# EAGLE design stknx_breakout_v14 (EAGLE 9.6.1)
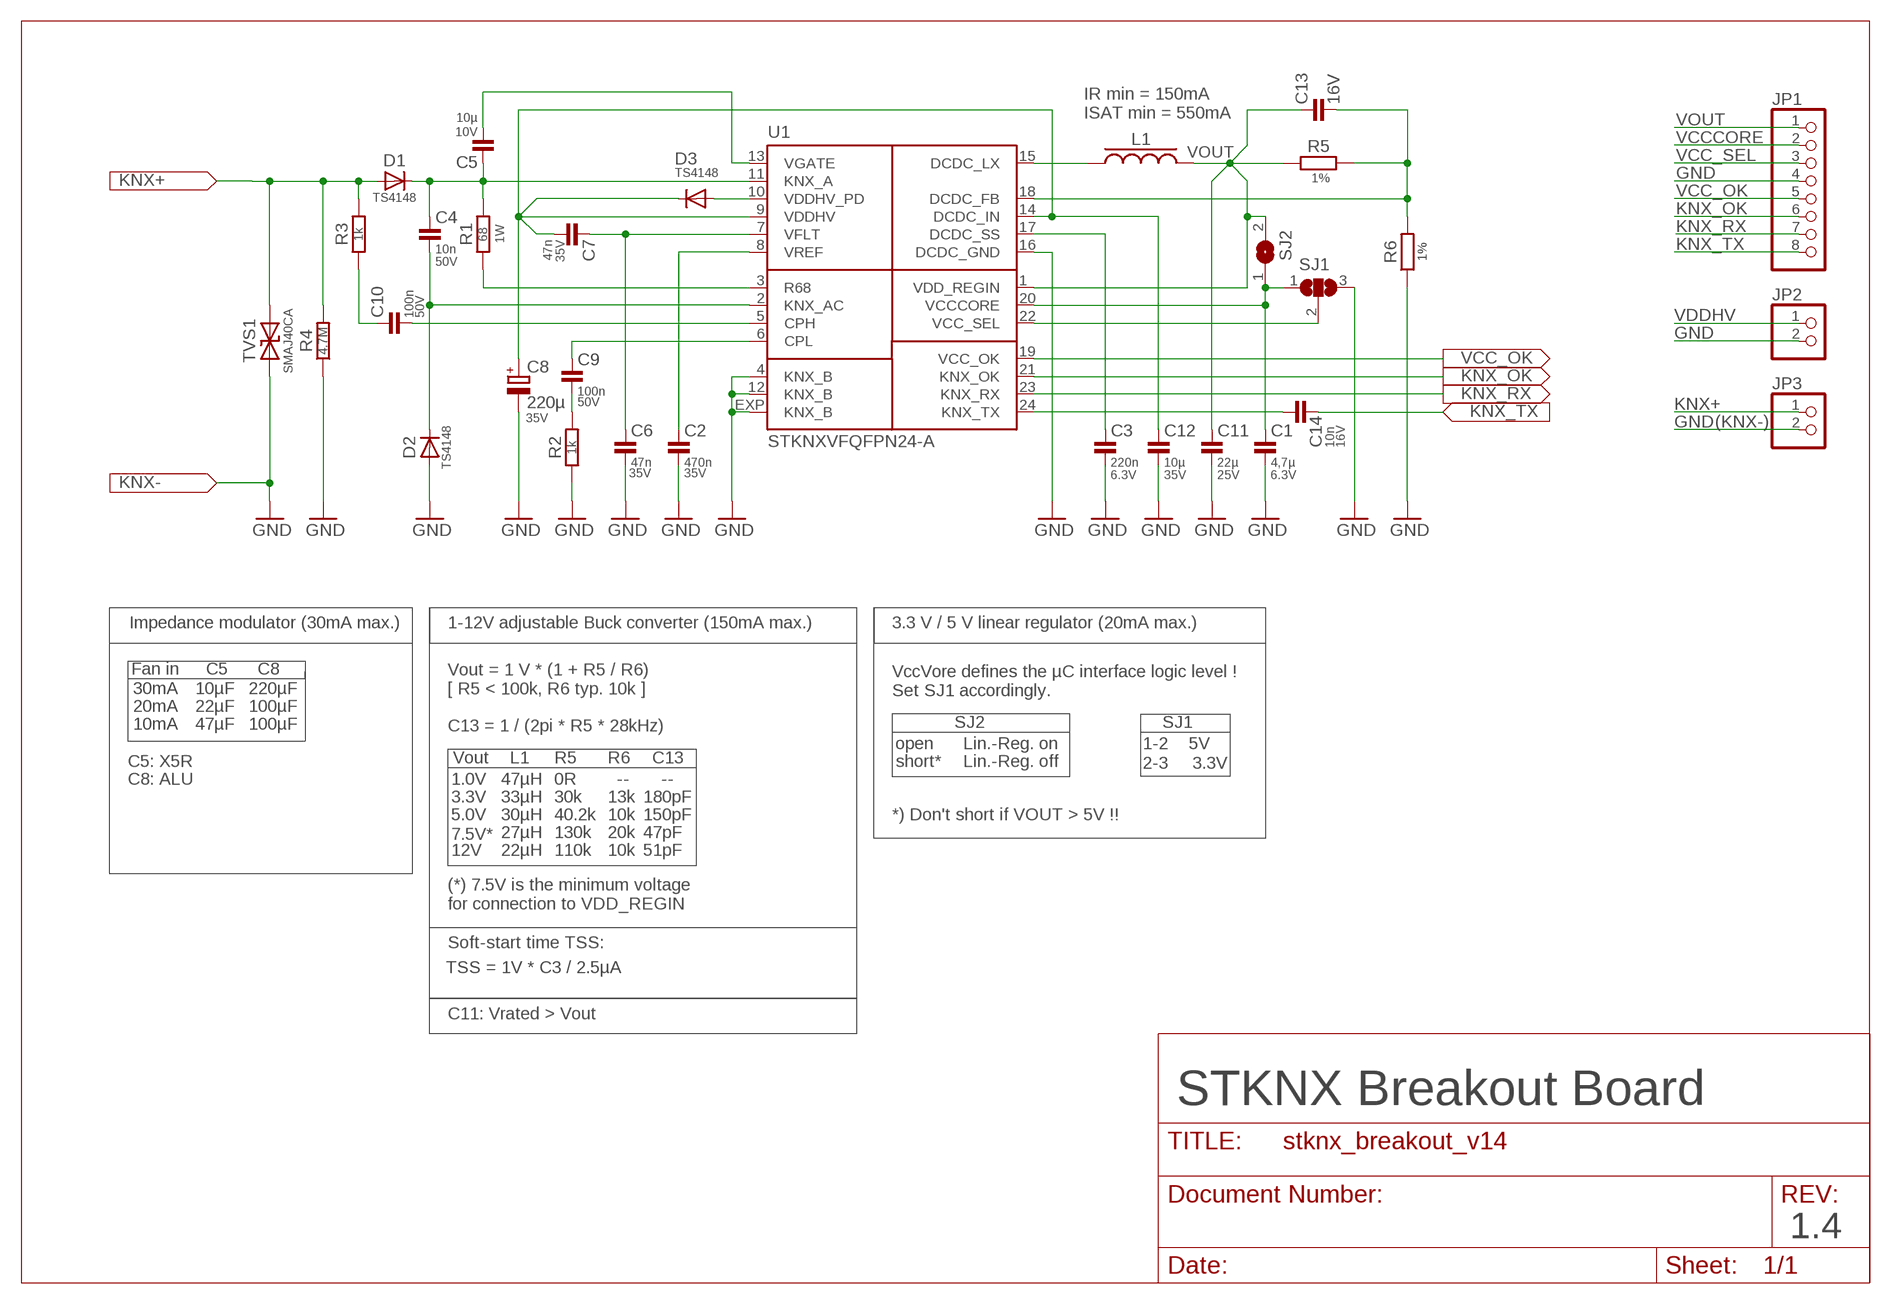
[diagram p0: schematic, sheet 1]

## Parts
C1  4,7µ  C-EUC0805  [C0805]
C2  470n  C-EUC0805  [C0805]
C3  220n  C-EUC0805  [C0805]
C4  10n  C-EUC0805  [C0805]
C5  10µ  C-EUC0805  [C0805]
C6  47n  C-EUC0805  [C0805]
C7  47n  C-EUC0805  [C0805]
C8  220µ  CPOL-EUF  [PANASONIC_F]
C9  100n  C-EUC0805  [C0805]
C10  100n  C-EUC0805  [C0805]
C11  22µ  C-EUC0805  [C0805]
C12  10µ  C-EUC0805  [C0805]
C13  C13  C-EUC0805  [C0805]
C14  10n  C-EUC0805  [C0805]
D1  TS4148  [0805]
D2  TS4148  [0805]
D3  TS4148  [0805]
JP1  PINHD-1X8  [1X08]
JP2  PINHD-1X2  [1X02]
JP3  PINHD-1X2  [1X02]
L1  L1  WE-LQS_4025_74404043220A  [WE-LQS_4025]
R1  68  R-EU_R2512  [R2512]
R2  1k  R-EU_R0805  [R0805]
R3  1k  R-EU_R0805  [R0805]
R4  4.7M  R-EU_R0805  [R0805]
R5  R5  R-EU_R0805  [R0805]
R6  R6  R-EU_R0805  [R0805]
SJ1  SJ2W  [SJ_2W]
SJ2  SJW  [SJW]
TVS1  SMAJ40CA  [DO-214AC(SMA)]
U1  STKNXVFQFPN24-A  [VFQFPN24-A]

## Nets
DCDC_FB: C13.2 R5.2 R6.2 U1.18(DCDC_FB)
DCDC_SS: C3.1 U1.17(DCDC_SS)
GND: C1.2 C2.2 C3.2 C6.2 C8.- C11.2 C12.2 D2.A JP1.4 JP2.2 JP3.2 R2.1 R4.1 R6.1 SJ1.3 TVS1.2(A2) U1.4(KNX_B) U1.12(KNX_B) U1.16(DCDC_GND) U1.EXP(KNX_B)
KNX+: D1.A JP3.1 R3.2 R4.2 TVS1.1(A1)
KNX_OK: JP1.6 U1.21(KNX_OK)
KNX_RX: JP1.7 U1.23(KNX_RX)
KNX_TX: C14.2 JP1.8
KNX_TX_1: C14.1 U1.24(KNX_TX)
N$1: C2.1 U1.8(VREF)
N$3: C6.1 C7.1 U1.7(VFLT)
N$4: R1.1 U1.3(R68)
N$6: C4.2 D2.C U1.2(KNX_AC)
N$7: C4.1 C5.1 D1.C R1.2 U1.11(KNX_A)
N$9: D3.A U1.10(VDDHV_PD)
N$10: C9.2 R2.2
N$11: C9.1 U1.6(CPL)
N$12: C10.1 R3.1
N$14: C10.2 U1.5(CPH)
N$15: L1.1 U1.15(DCDC_LX)
VCC_OK: JP1.5 U1.19(VCC_OK)
VCC_SEL: JP1.3 SJ1.2 U1.22(VCC_SEL)
VCCCORE: C1.1 JP1.2 SJ1.1 SJ2.1 U1.20(VCCCORE)
VDDHV: C7.2 C8.+ C12.1 D3.C JP2.1 U1.9(VDDHV) U1.14(DCDC_IN)
VGATE: C5.2 U1.13(VGATE)
VOUT: C11.1 C13.1 JP1.1 L1.2 R5.1 SJ2.2 U1.1(VDD_REGIN)

## Notes on the sheet
- IR min = 150mA
  ISAT min = 550mA
- 1W
- (KNX-)
- Impedance modulator (30mA max.) | 1-12V adjustable Buck converter (150mA max.) | 3.3 V / 5 V linear regulator (20mA max.)
- Fan in | C5 | C8
- 30mA | 10µF | 220µF
- VccVore defines the µC interface logic level !
  Set SJ1 accordingly.
- 20mA | 22µF | 100µF
- 10mA | 47µF | 100µF | SJ2 | SJ1
- Vout = 1 V * (1 + R5 / R6)
  [ R5 < 100k, R6 typ. 10k ]
  
  C13 = 1 / (2pi * R5 * 28kHz)
- open | Lin.-Reg. on | 1-2 | 5V
- C5: X5R | Vout | L1 | R5 | R6 | C13 | short* | Lin.-Reg. off
- 2-3 | 3.3V
- C8: ALU | 1.0V | 47µH | 0R | -- | --
- 3.3V | 33µH | 30k | 13k | 180pF
- 5.0V | 30µH | 40.2k | 10k | 150pF | *) Don't short if VOUT > 5V !!
- 7.5V* | 27µH | 130k | 20k | 47pF
- 12V | 22µH | 110k | 10k | 51pF
- (*) 7.5V is the minimum voltage
  for connection to VDD_REGIN
- Soft-start time TSS:
- TSS = 1V * C3 / 2.5µA
- C11: Vrated > Vout
- STKNX Breakout Board
- 1.4

## Library data of the parts
C1 = MyRCL:C-EU: CAPACITOR, European symbol; DIELECTRIC: X5R; SPICEPREFIX: C; TYPE: MLCC; VOLTAGE: 6.3V
C2 C6 C7 C12 = MyRCL:C-EU: CAPACITOR, European symbol; SPICEPREFIX: C; TYPE: MLCC; VOLTAGE: 35V
C3 = MyRCL:C-EU: CAPACITOR, European symbol; SPICEPREFIX: C; TYPE: MLCC; VOLTAGE: 6.3V
C4 C9 C10 = MyRCL:C-EU: CAPACITOR, European symbol; SPICEPREFIX: C; TYPE: MLCC; VOLTAGE: 50V
C5 = MyRCL:C-EU: CAPACITOR, European symbol; DIELECTRIC: X5R; SPICEPREFIX: C; TYPE: MLCC; VOLTAGE: 10V
C8 = resistor:CPOL-EU: POLARIZED CAPACITOR, European symbol; PANASONIC: EEEFT1H221AP; REICHELT: FT-V 220U 50; TYPE: ELYT; VOLTAGE: 35V
C11 = MyRCL:C-EU: CAPACITOR, European symbol; DIELECTRIC: X5R; SPICEPREFIX: C; TYPE: MLCC; VOLTAGE: 25V
C13 C14 = MyRCL:C-EU: CAPACITOR, European symbol; SPICEPREFIX: C; TYPE: MLCC; VOLTAGE: 16V
D1-D3 = MyDiode:TS4148: Small Signal Fast Switching Diodes
JP1 = pinhead:PINHD-1X8: PIN HEADER
JP2 JP3 = pinhead:PINHD-1X2: PIN HEADER
L1 = MyPowerMagnetics:WE-LQS_4025: SMD Shielded Tiny Power Inductor Characteristics Tiny Power Inductor design 1.7 times more current in comparison with unshielded versions Robust design & high durability Low RDC Magnetically shielded with magnetic glue reducing buzz noise in ultra-low levels Operating Temperature: –40 °C to +125 °C Applications Integrated DC/DC Converters Switching controllers which required high efficiency Portable power (Smartphones, digital cameras, Tablets, etc.) Embedded laptops and PCs Big sizes (5040, 60xx, 8040) used for shock-proof circuits <http://katalog.we-online.de/media/images/v2/Family_WE-LQS.jpg> Details see: http://katalog.we-online.de/en/pbs/WE-LQS Created by Dan Xu 2014-05-21 2014 (C) Wurth Elektronik; WE-NUMBER: 74404043220A/22uH
R1-R4 = MyRCL:R-EU_: RESISTOR, European symbol
R5 R6 = MyRCL:R-EU_: RESISTOR, European symbol; TOLERANCE: 1%
SJ1 = MyJumper:SJ2: SMD solder JUMPER
SJ2 = MyJumper:SJ: SMD solder JUMPER
TVS1 = MyDiode:SMAJ*CA: Transient Voltage Suppressor Diode https://www.vishay.com/docs/88390/smaj50a.pdf; MARKING: YR; WURTH_ELEKTRONICS: 824501401
U1 = stknx:STKNX: STKNX Miniature KNX transceiver with voltage regulators see: http://www.st.com/content/st_com/en/products/interfaces-and-transceivers/power-line-transceivers/stknx.html

## Board
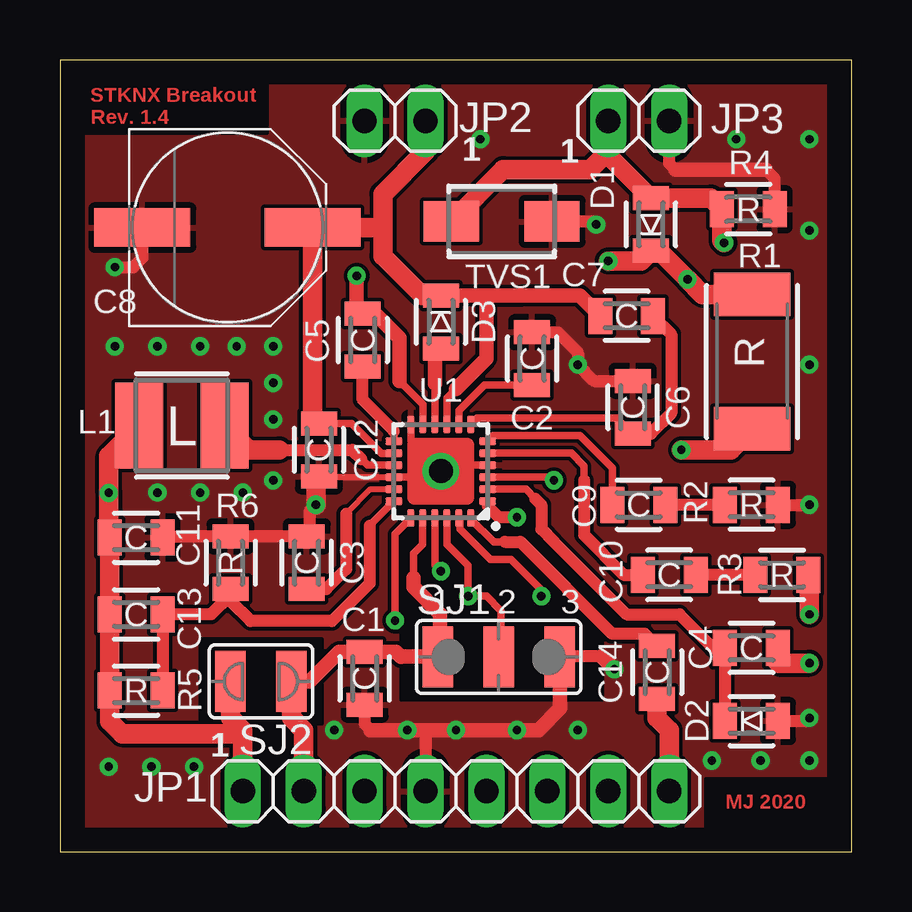
[diagram p1: board, top side]
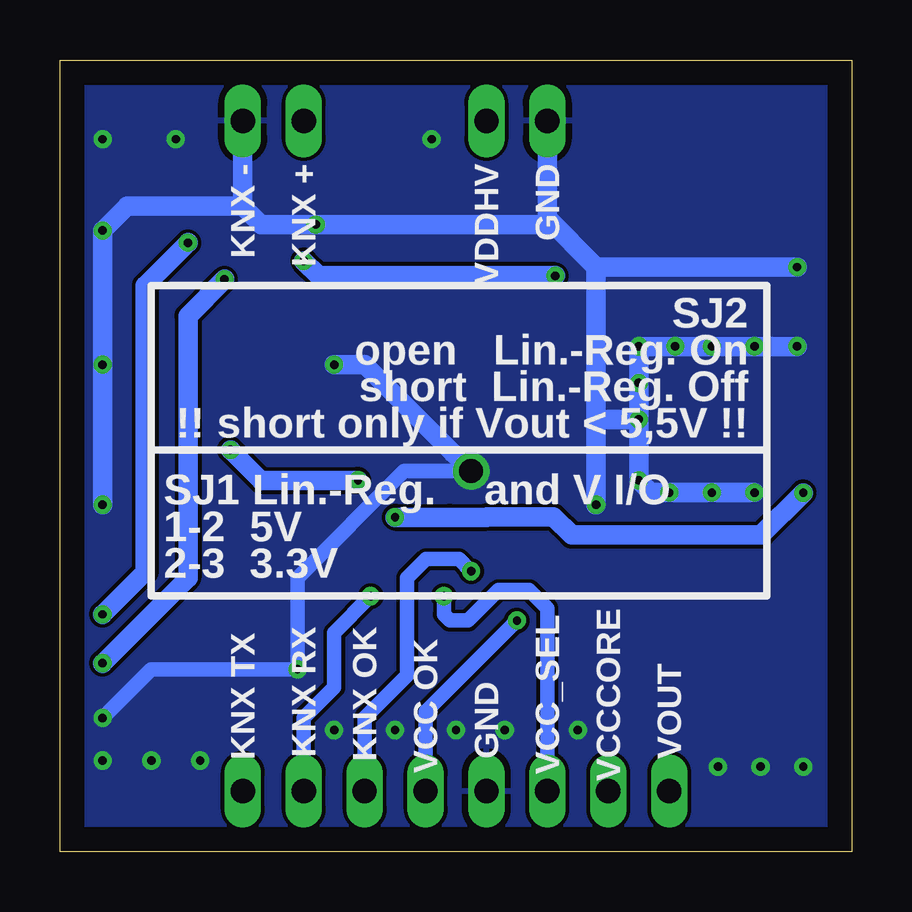
[diagram p2: board, bottom side, seen from below]

Size 33.02 x 33.02 mm. Coordinates in mm from the lower left corner, seen from the top.
Outline: 33.02,33.02 0,33.02 0,0 33.02,0 33.02,33.02
Copper layers (1*16): Top 0.035mm / dielectric 1.5mm / Bottom 0.035mm
Design rules "default *": minimum track width 6mil, minimum drill 0.35mm, track to track 6mil, track to pad 6mil, pad to pad 6mil, via to via 6mil, smd to smd 6mil, copper to edge 40mil, drill to drill 6mil, minimum pad ring 10mil, minimum via ring 8mil, stop-mask expansion 4mil, vias tented up to drill 0mil, thermal gap 10mil

### Footprints (pad centres in the part's own frame; a part is rotated, then mirrored left to right if it is on the bottom)
C0805 = smd 1 x 1.5: 1 -1.1,0; 2 1.1,0
PANASONIC_F = smd 4 x 1.6: + 3.55,0; - -3.55,0
0805 = smd 1 x 1.5: A 1.1,0; C -1.1,0
1X08 = drill 1.016 long: 1 -8.89,0; 2 -6.35,0; 3 -3.81,0; 4 -1.27,0; 5 1.27,0; 6 3.81,0; 7 6.35,0; 8 8.89,0
1X02 = drill 1.016 long: 1 -1.27,0; 2 1.27,0
WE-LQS_4025 = smd 2 x 3.6: 1 -1.775,0; 2 1.775,0
R2512 = smd 1.8 x 3.2: 1 -2.8,0; 2 2.8,0
R0805 = smd 1 x 1.5: 1 -1.1,0; 2 1.1,0
SJ_2W = smd 1.27 x 2.54: 1 -2.54,0; 2 0,0; 3 2.54,0
SJW = smd 1.27 x 2.54: 1 -1.27,0; 2 1.27,0
DO-214AC(SMA) = smd 2.3 x 1.7: 1 -2.1,0; 2 2.1,0
VFQFPN24-A = smd 0.7 x 0.3: 1 -1.95,1.25; 2 -1.95,0.75; 3 -1.95,0.25; 4 -1.95,-0.25; 5 -1.95,-0.75; 6 -1.95,-1.25; 13 1.95,-1.25; 14 1.95,-0.75; 15 1.95,-0.25; 16 1.95,0.25; 17 1.95,0.75; 18 1.95,1.25 | smd 0.3 x 0.7: 7 -1.25,-1.95; 8 -0.75,-1.95; 9 -0.25,-1.95; 10 0.25,-1.95; 11 0.75,-1.95; 12 1.25,-1.95; 19 1.25,1.95; 20 0.75,1.95; 21 0.25,1.95; 22 -0.25,1.95; 23 -0.75,1.95; 24 -1.25,1.95 | drill 1: EXP 0,0

### Placement (x,y rotation side)
C1  12.7,7.24 270 top
C2  19.68,20.57 90 top
C3  10.29,12.06 90 top
C4  28.83,8.51 180 top
C5  12.62,21.34 270 top
C6  23.88,18.54 90 top
C7  23.62,22.35 180 top
C8  6.99,26.04 0 top
C9  24.13,14.48 0 top
C10  25.4,11.56 180 top
C11  3.17,13.11 0 top
C12  10.79,16.76 270 top
C13  3.17,9.91 0 top
C14  24.89,7.49 270 top
D1  24.64,26.16 90 top
D2  28.83,5.46 0 top
D3  15.88,22.1 270 top
JP1  16.51,2.54 0 top
JP2  13.97,30.48 180 top
JP3  24.13,30.48 0 top
L1  5.08,17.78 180 top
R1  28.85,20.45 90 top
R2  28.83,14.48 180 top
R3  30.1,11.56 0 top
R4  28.7,26.8 180 top
R5  3.17,6.73 0 top
R6  7.11,12.06 270 top
SJ1  18.29,8.13 0 top
SJ2  8.38,7.11 180 top
TVS1  18.41,26.29 0 top
U1  15.88,15.88 180 top

### Tracks (layer width: path | path; a pad name or v marks a point on that pad's centre or on a via)
DCDC_FB
  Top 0.152: R6.2 7.11,10.71 | 5.71,9.91 C13.2
  Top 0.305: U1.18 12.91,13.61 | R6.2 7.11,10.45
  Top 0.508: R5.2 C13.2 5.71,9.91 6.31,9.91 7.11,10.71 | 12.91,13.61 12.91,11.2 11.34,9.63 7.94,9.63 7.11,10.45
DCDC_SS
  Top 0.254: 11.93,14.1 12.96,15.12 U1.17
  Top 0.508: C3.1 11.1,10.96 11.93,11.8 11.93,14.1
GND  (via drill 0.35)
  Top 0.152: 4.33,13.16 C11.2 | 13.91,15.64 U1.16 | U1.EXP 14.62,17.12 | 16.12,16.12 U1.EXP | U1.EXP 15.62,15.62 | 20.85,8.1 20.85,6.6
  Top 0.254: 13.91,15.64 10.86,15.64 10.84,15.66
  Top 0.305: 14.62,17.12 U1.12 | U1.4 16.12,16.12 | 15.62,15.62 U1.16 | 10.84,15.66 C12.2 10.67,15.54
  Top 0.508: 4.33,13.16 5.59,13.16 5.84,13.16 6.35,13.16 R6.1 C3.2 10.41,13.29 10.41,14.22 v10.67,14.48 | v22.35,26.16 22.23,26.29 TVS1.2 | C2.2 20.74,21.67 21.59,20.83 v21.59,20.32 22.27,19.64 C6.2 | R2.1 v31.24,14.48 | v31.24,5.59 31.11,5.46 D2.A | R4.1 29.8,28.07 29.42,28.45 | 25.65,28.45 25.4,28.7 JP3.2 | v2.29,24.38 3.05,24.38 3.44,24.77 C8.- | 15.24,5.08 JP1.4 | C1.2 12.7,5.33 12.95,5.08 | 22.58,8.15 20.85,8.15
  Top 0.61: 29.42,28.45 25.65,28.45 | 20.85,8.08 20.85,6.6 20.85,6 19.94,5.08 v19.05,5.08 v16.51,5.08 16,5.08 v14.48,5.08 | v14.48,5.08 15.24,5.08 | 12.95,5.08 v14.48,5.08 | v23.11,7.62 22.58,8.15 | 20.85,8.15 SJ1.3
  Top 0.813: v10.67,14.48 10.67,15.54
  Bottom 0.61: U1.EXP 18.67,15.88 23.11,11.43 v23.11,7.62 29.21,7.62 v31.24,5.59
  Bottom 0.813: 12.7,26.16 v22.35,26.16 24.64,26.16 25.4,26.92 | 12.7,26.16 12.83,26.29 12.7,26.42 | 12.7,26.42 10.67,24.38 | 10.67,24.38 10.67,18.03 | 10.67,18.03 v10.67,14.48 | v21.59,20.32 20.32,20.32 16.64,16.64 U1.EXP | v31.24,14.48 v31.24,20.32 31.24,23.11 v31.24,25.91 30.23,26.92 25.4,26.92 | 12.7,26.42 12.7,28.45 12.7,28.7 | 12.7,26.16 12.7,26.42 | 12.7,26.42 12.7,28.7 | 12.7,28.7 JP2.2 | JP3.2 25.4,29.21 25.4,26.92 | v2.29,21.08 v4.06,21.08 v5.84,21.08 v7.37,21.08 v8.89,21.08 v8.89,19.56 v8.89,18.03 | v8.89,18.03 v8.89,15.49 8.38,14.99 v7.62,14.99 v5.84,14.99 v4.06,14.99 | v8.89,18.03 10.67,18.03 | v2.29,24.38 10.67,24.38
  other vias: 21.59,5.08 11.43,5.08 2.03,3.56 3.81,3.56 5.59,3.56 27.18,3.81 29.21,3.81 31.24,3.81 17.53,29.72 28.19,29.72 31.24,29.72
  pour Bottom: 0.64,32.38 32.38,32.38 32.38,0.64 0.64,0.64
  pour Top: 0.64,32.38 32.38,32.38 32.38,0.64 0.64,0.64
KNX+  (via drill 0.35)
  Top 0.813: R3.2 31.24,11.51 v31.24,9.91 | TVS1.1 18.47,28.45 22.1,28.45 22.86,29.21 JP3.1 22.86,29.04 D1.A 27.14,27.26 R4.2 27.6,25.48 v27.69,25.4
  Bottom 0.813: v31.24,9.91 29.46,11.68 29.46,23.62 v27.69,25.4
KNX_OK  (via drill 0.35)
  Top 0.305: U1.21 15.62,11.96 v15.88,11.71
  Bottom 0.61: v15.88,11.71 16.39,12.21 17.76,12.21 18.54,11.43 18.54,7.37 20.32,5.59 JP1.6
KNX_RX  (via drill 0.35)
  Top 0.305: U1.23 16.67,13.88 16.67,13.47 17.95,12.19 18.8,12.19 20.07,10.92 v20.07,10.67
  Bottom 0.61: v20.07,10.67 21.59,9.14 21.59,6.86 22.86,5.59 JP1.7
KNX_TX
  Top 0.813: C14.2 24.89,5.59 25.4,5.08 JP1.8
KNX_TX_1
  Top 0.305: U1.24 17.14,13.9 17.14,13.87 18.09,12.93 18.54,12.93
  Top 0.508: 18.54,12.93 19.19,12.93 23.02,9.1 24.38,9.1 C14.1
N$1
  Top 0.305: U1.8 16.62,18.4 17.7,19.47 C2.1
N$2
  cutout Top: 5.84,8.89 5.84,5.33 10.92,5.33 10.92,8.89
N$3
  Top 0.254: C6.1 23.23,18.09
  Top 0.305: U1.7 17.39,18.09 18.29,18.09 23.23,18.09
  Top 0.508: C7.1 25.48,21.59 25.48,18.29 24.64,17.44 C6.1
N$4  (via drill 0.35)
  Top 0.305: U1.3 20.47,15.62 v20.59,15.5
  Top 0.813: R1.1 27.97,16.76 v25.91,16.76
  Bottom 0.813: v25.91,16.76 24.64,15.5 v20.59,15.5
N$5
  cutout Top: 14.22,9.91 14.22,6.35 22.61,6.35 22.61,9.91
N$6
  Top 0.152: 19.31,15.12 19.3,15.12
  Top 0.305: 19.3,15.12 U1.2 | 19.81,14.73 19.42,15.12 19.31,15.12
  Top 0.508: D2.C C4.2 27.22,8.51 25.82,9.91 23.62,9.91 20.57,12.95 20.07,13.46 20.07,14.48 19.81,14.73
N$7  (via drill 0.35)
  Top 0.305: U1.11 15.12,18.66 14.15,19.64
  Top 0.61: 14.15,19.64 14.15,21.42 13.13,22.44 C5.1 12.37,22.69 v12.37,24.02
  Top 0.813: C4.1 29.84,8.43 29.84,8 29.97,7.87 v31.24,7.87 | v22.86,24.64 24.21,24.64 D1.C 24.98,25.06 v26.16,23.88 26.79,23.25 R1.2
  Bottom 0.813: v26.16,23.88 27.69,22.35 27.69,11.43 v31.24,7.87 | v12.37,24.02 22.25,24.02 v22.86,24.64
N$8
  cutout Top: 13.97,17.78 17.78,17.78 17.78,13.97 13.97,13.97
N$9
  Top 0.305: U1.10 15.62,19.54
  Top 0.508: 15.62,20.75 D3.A
  Top 0.61: 15.62,19.54 15.62,20.75
N$10
  Top 0.508: R2.2 C9.2
N$11
  Top 0.305: U1.6 18.05,17.35 21.68,17.35 23.03,16 C9.1
N$12
  Top 0.508: R3.1 C10.1
N$13
  cutout Top: 1.02,32 8.64,32 8.64,29.97 1.02,29.97
N$14
  Top 0.305: U1.5 21.32,16.62 21.84,16.1 21.84,15.49
  Top 0.508: 21.84,15.49 21.84,13.21 23.5,11.56 C10.2
N$15
  Top 0.305: 12.57,16.38 12.82,16.12 U1.15
  Top 0.508: 9.14,16.76 12.18,16.76 12.57,16.38
  Top 0.813: L1.1 7.87,16.76 9.14,16.76
N$16
  cutout Top: 32,1.02 32,3.05 26.92,3.05 26.92,1.02
VCC_OK  (via drill 0.35)
  Top 0.305: U1.19 13.97,13.27 v13.97,9.65
  Bottom 0.61: v13.97,9.65 17.78,5.84 JP1.5
VCC_SEL  (via drill 0.35)
  Top 0.305: U1.22 16.12,12.83 17.02,11.94 v17.02,10.67 17.78,10.67 18.39,10.06 18.39,8.23 SJ1.2
  Bottom 0.61: JP1.3 12.7,10.16 13.46,10.92 14.73,10.92 16,9.65 16.76,9.65 17.02,9.91 v17.02,10.67
VCCCORE
  Top 0.152: U1.20 15.12,13.92 | 15.75,9.83 15.85,9.93
  Top 0.305: 15.12,13.92 15.12,12.83 14.73,12.45 14.73,11.43 | SJ1.1 15.77,8.15 15.85,8.15
  Top 0.61: 14.73,11.43 14.73,11.05 15.85,9.93 15.85,8.15 | 14.01,8.34 C1.1 11.64,8.34 10.41,7.11 SJ2.1 | 14.22,8.13 14.01,8.34 | 15.85,8.15 15.82,8.13 | 14.01,8.34 14.2,8.15 15.85,8.15
  Top 0.813: JP1.2 10.16,5.08 9.65,5.59 SJ2.1
VDDHV
  Top 0.152: 13.63,16.62 U1.14 | 10.54,18.12 C12.1
  Top 0.305: C12.1 12.16,17.86 13.4,16.62 13.63,16.62 | U1.9 16.12,18.92 16.26,19.05 16.51,19.3
  Top 0.61: 19.3,23.2 17.86,23.2 D3.C | C7.2 21.68,23.2 19.3,23.2 | 19.3,23.2 17.78,23.2 17.78,20.57 16.51,19.3
  Top 0.813: 13.46,26.04 13.46,24.85 15.11,23.2 D3.C | C12.1 10.54,18.12 C8.+ 13.46,26.04 | JP2.1 15.24,29.21 13.46,27.43 13.46,26.04
VGATE
  Top 0.305: 13.93,17.55 U1.13 | 12.7,18.77 12.62,18.85
  Top 0.508: 13.93,17.55 12.7,18.77 | 12.62,18.85 C5.2
VOUT  (via drill 0.35)
  Top 0.305: 17.82,14.43 U1.1
  Top 0.508: v19.05,13.96 18.3,13.96 17.82,14.43
  Top 0.813: L1.2 2.03,16.51 v2.03,14.97 2.03,13.15 C11.1 C13.1 R5.1 2.08,5.44 2.59,4.93 7.47,4.93 7.62,5.08 | 7.62,5.08 7.11,5.59 SJ2.2 | 7.62,5.08 JP1.1
  Bottom 0.813: v19.05,13.96 16.76,13.96 15.24,13.96 15.23,13.97 12.45,13.97 11.68,13.21 3.8,13.21 v2.03,14.97

### Text on the board
Top: STKNX Breakout / Rev. 1.4 | MJ 2020
tPlace: 1 | 1 | 1 | 2 | 3 | 1
bPlace: GND | VDDHV | KNX + | KNX - | SJ2 / open Lin.-Reg. On / short Lin.-Reg. Off / !! short only if Vout < 5,5V !! | SJ1 Lin.-Reg. and V I/O / 1-2 5V / 2-3 3.3V | VCCCORE | VCC_SEL | VCC OK | KNX OK | KNX RX | KNX TX | VOUT | GND